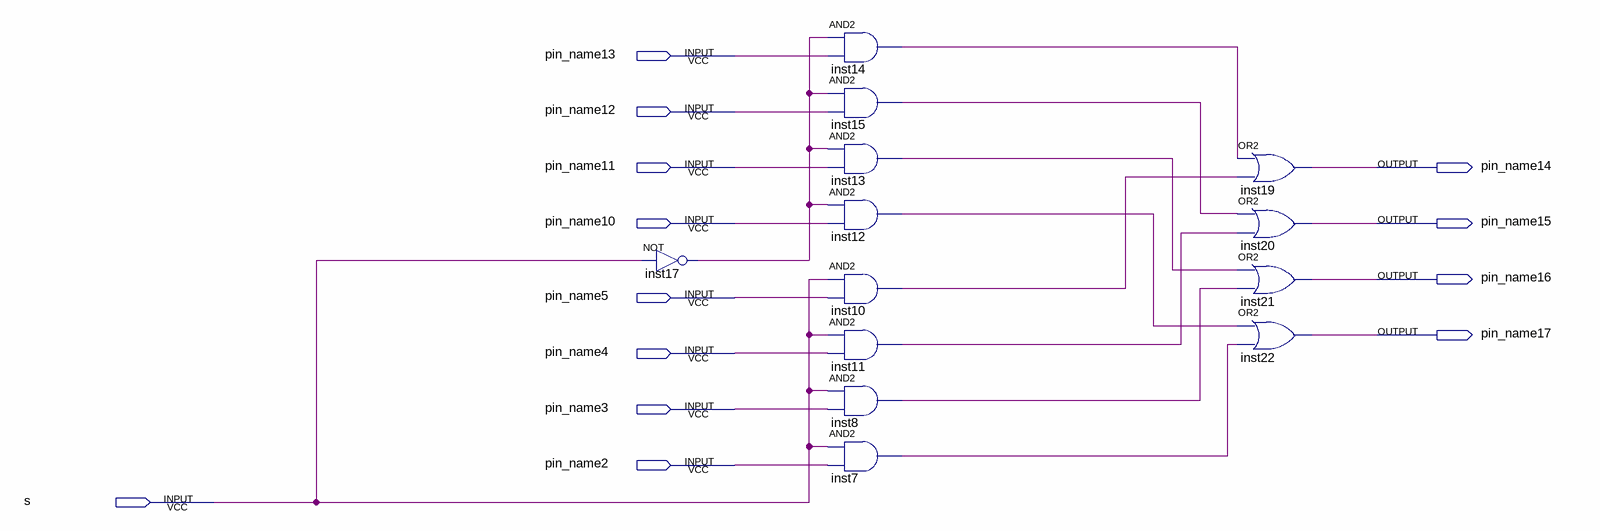
[diagram p0: schematic sheet]
// Quartus schematic seletor2x1.bdf as structural Verilog: 13 symbols, 13 pins
module seletor2x1 (
  input  pin_name13,
  input  pin_name12,
  input  pin_name11,
  input  pin_name10,
  input  pin_name5,
  input  pin_name4,
  input  pin_name3,
  input  pin_name2,
  input  s,
  output pin_name14,
  output pin_name15,
  output pin_name16,
  output pin_name17
);

  wire inst7_out, inst8_out, inst10_out, inst11_out, inst12_out, inst13_out, inst14_out, inst15_out,
       inst17_out;

  not inst17 (inst17_out, s);
  and inst14 (inst14_out, inst17_out, pin_name13);
  and inst15 (inst15_out, inst17_out, pin_name12);
  and inst13 (inst13_out, inst17_out, pin_name11);
  and inst12 (inst12_out, inst17_out, pin_name10);
  and inst10 (inst10_out, s, pin_name5);
  and inst11 (inst11_out, s, pin_name4);
  and inst8 (inst8_out, s, pin_name3);
  and inst7 (inst7_out, s, pin_name2);
  or inst19 (pin_name14, inst14_out, inst10_out);
  or inst20 (pin_name15, inst15_out, inst11_out);
  or inst21 (pin_name16, inst13_out, inst8_out);
  or inst22 (pin_name17, inst12_out, inst7_out);
endmodule
